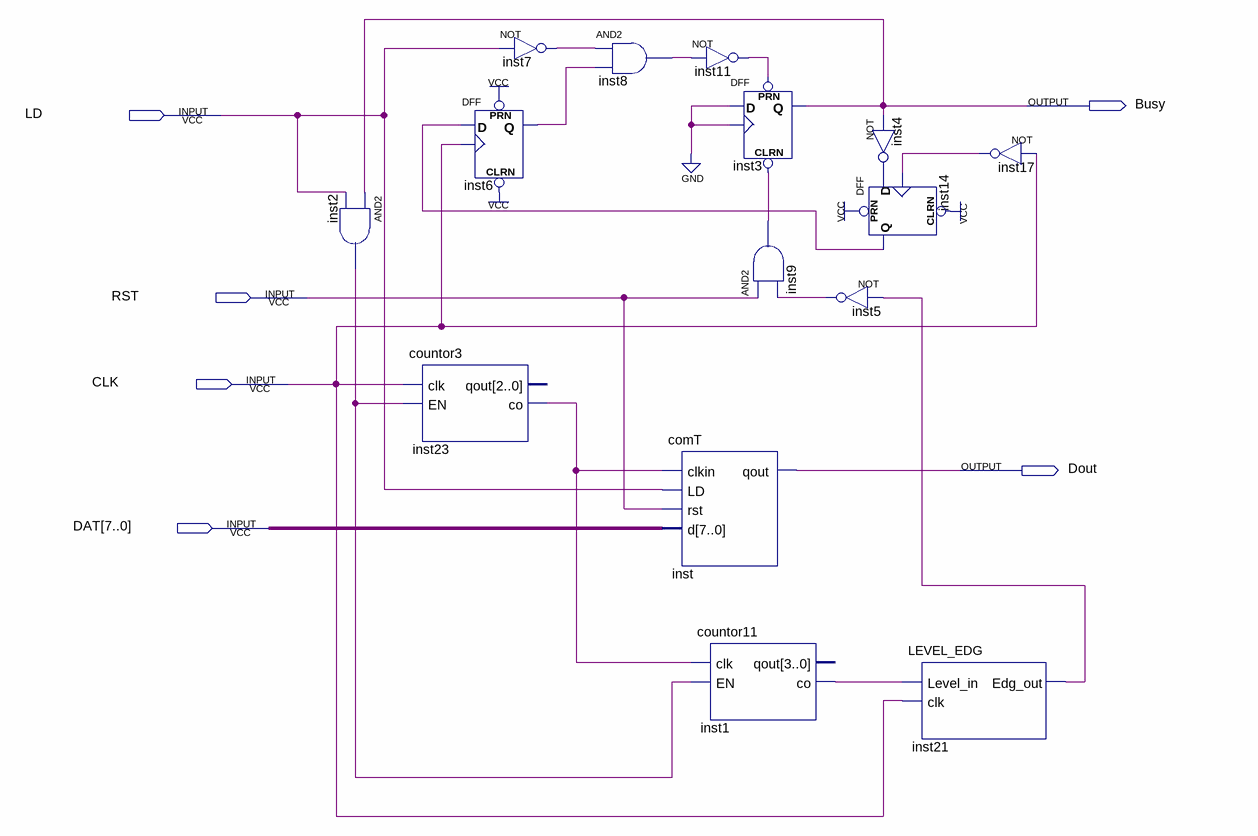
[diagram p0: schematic sheet]
// Quartus schematic comtx.bdf as structural Verilog: 15 symbols, 6 pins
module comtx (
  input  LD,
  input  RST,
  input  CLK,
  input  [7:0] DAT,
  output Busy,
  output Dout
);

  wire inst1_co, inst2_out, inst4_out, inst5_out, inst6_q, inst7_out, inst8_out, inst9_out, inst11_out,
       inst14_q, inst17_out, inst21_edg_out, inst23_co;

  and inst2 (inst2_out, Busy, LD);
  countor3 inst23 (.clk(CLK), .EN(inst2_out), .co(inst23_co));  // open: qout
  not inst7 (inst7_out, LD);
  DFF inst6 (.CLRN(1'b1), .CLK(CLK), .D(inst14_q), .PRN(1'b1), .Q(inst6_q));
  and inst8 (inst8_out, inst7_out, inst6_q);
  comT inst (.clkin(inst23_co), .LD(LD), .rst(RST), .d(DAT), .qout(Dout));
  not inst11 (inst11_out, inst8_out);
  DFF inst3 (.CLRN(inst9_out), .CLK(1'b0), .D(1'b0), .PRN(inst11_out), .Q(Busy));
  and inst9 (inst9_out, RST, inst5_out);
  countor11 inst1 (.clk(inst23_co), .EN(inst2_out), .co(inst1_co));  // open: qout
  not inst5 (inst5_out, inst21_edg_out);
  not inst4 (inst4_out, Busy);
  DFF inst14 (.CLRN(1'b1), .CLK(inst17_out), .D(inst4_out), .PRN(1'b1), .Q(inst14_q));
  LEVEL_EDG inst21 (.Level_in(inst1_co), .clk(CLK), .Edg_out(inst21_edg_out));
  not inst17 (inst17_out, CLK);
endmodule
